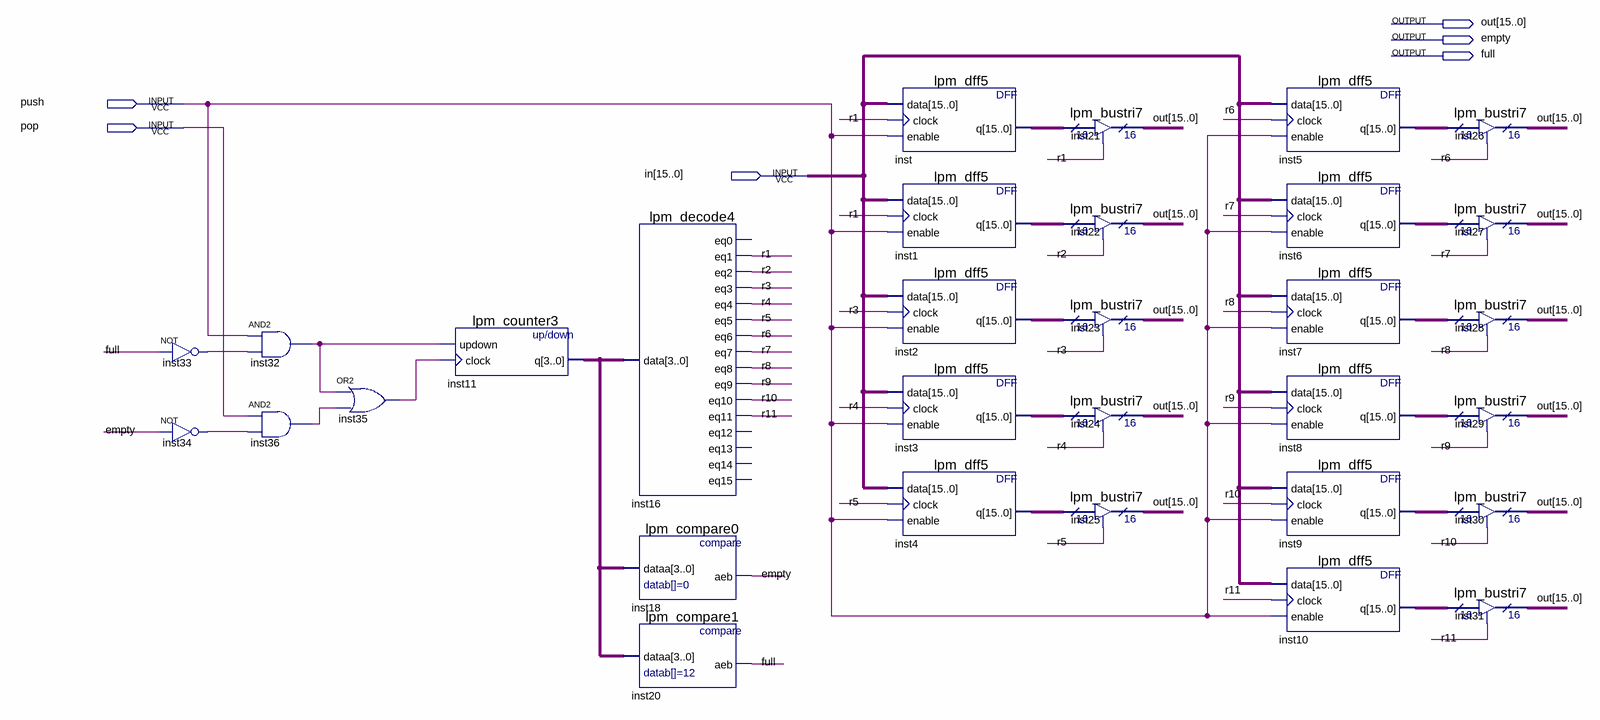
[diagram p0: schematic sheet]
// Quartus schematic stack.bdf as structural Verilog: 31 symbols, 6 pins
module stack (
  input  push,
  input  pop,
  input  [15:0] in,
  output [15:0] out,
  output empty,
  output full
);

  wire inst32_out, inst33_out, inst34_out, inst35_out, inst36_out, r1, r2, r3, r4, r5, r6, r7, r8, r9, r10,
       r11;
  wire [3:0] inst11_q;
  wire [15:0] inst1_q, inst2_q, inst3_q, inst4_q, inst5_q, inst6_q, inst7_q, inst8_q, inst9_q, inst10_q,
       inst_q;

  not inst33 (inst33_out, full);
  not inst34 (inst34_out, empty);
  and inst32 (inst32_out, push, inst33_out);
  and inst36 (inst36_out, pop, inst34_out);
  or inst35 (inst35_out, inst32_out, inst36_out);
  lpm_counter3 inst11 (.updown(inst32_out), .clock(inst35_out), .q(inst11_q));
  lpm_decode4 inst16 (
    .data(inst11_q), .eq1(r1), .eq2(r2), .eq3(r3), .eq4(r4), .eq5(r5), .eq6(r6), .eq7(r7), .eq8(r8),
    .eq9(r9), .eq10(r10), .eq11(r11));  // open: eq0, eq12, eq13, eq14, eq15
  lpm_compare0 inst18 (.dataa(inst11_q), .aeb(empty));
  lpm_compare1 inst20 (.dataa(inst11_q), .aeb(full));
  lpm_dff5 inst (.data(in), .clock(r1), .enable(push), .q(inst_q));
  lpm_dff5 inst1 (.data(in), .clock(r1), .enable(push), .q(inst1_q));
  lpm_dff5 inst2 (.data(in), .clock(r3), .enable(push), .q(inst2_q));
  lpm_dff5 inst3 (.data(in), .clock(r4), .enable(push), .q(inst3_q));
  lpm_dff5 inst4 (.data(in), .clock(r5), .enable(push), .q(inst4_q));
  lpm_bustri7 inst21 (.enabledt(r1), .data(inst_q), .tridata(out));
  lpm_bustri7 inst22 (.enabledt(r2), .data(inst1_q), .tridata(out));
  lpm_bustri7 inst23 (.enabledt(r3), .data(inst2_q), .tridata(out));
  lpm_bustri7 inst24 (.enabledt(r4), .data(inst3_q), .tridata(out));
  lpm_bustri7 inst25 (.enabledt(r5), .data(inst4_q), .tridata(out));
  lpm_dff5 inst5 (.data(in), .clock(r6), .enable(push), .q(inst5_q));
  lpm_dff5 inst6 (.data(in), .clock(r7), .enable(push), .q(inst6_q));
  lpm_dff5 inst7 (.data(in), .clock(r8), .enable(push), .q(inst7_q));
  lpm_dff5 inst8 (.data(in), .clock(r9), .enable(push), .q(inst8_q));
  lpm_dff5 inst9 (.data(in), .clock(r10), .enable(push), .q(inst9_q));
  lpm_dff5 inst10 (.data(in), .clock(r11), .enable(push), .q(inst10_q));
  lpm_bustri7 inst26 (.enabledt(r6), .data(inst5_q), .tridata(out));
  lpm_bustri7 inst27 (.enabledt(r7), .data(inst6_q), .tridata(out));
  lpm_bustri7 inst28 (.enabledt(r8), .data(inst7_q), .tridata(out));
  lpm_bustri7 inst29 (.enabledt(r9), .data(inst8_q), .tridata(out));
  lpm_bustri7 inst30 (.enabledt(r10), .data(inst9_q), .tridata(out));
  lpm_bustri7 inst31 (.enabledt(r11), .data(inst10_q), .tridata(out));
endmodule
